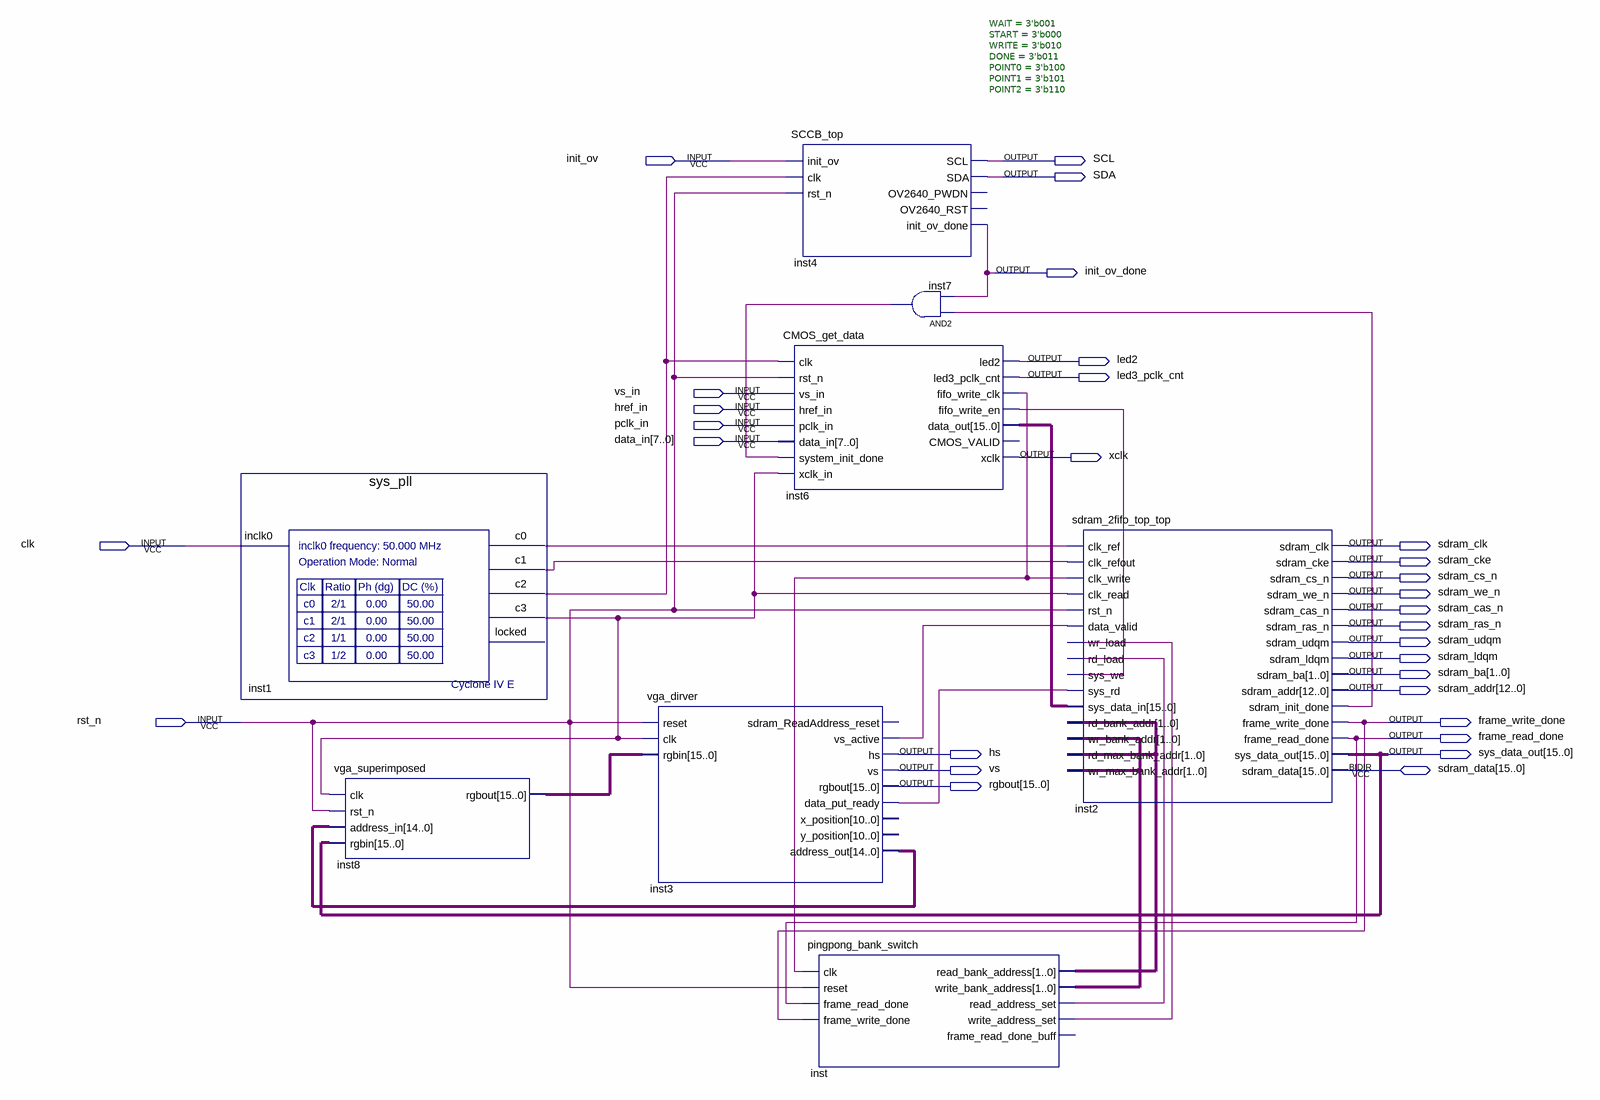
[diagram p0: schematic sheet]
// Quartus schematic sdram_test.bdf as structural Verilog: 8 symbols, 30 pins
module sdram_test (
  input  init_ov,
  input  vs_in,
  input  href_in,
  input  pclk_in,
  input  [7:0] data_in,
  input  clk,
  input  rst_n,
  inout  [15:0] sdram_data,
  output SCL,
  output SDA,
  output init_ov_done,
  output led2,
  output led3_pclk_cnt,
  output xclk,
  output sdram_clk,
  output sdram_cke,
  output sdram_cs_n,
  output sdram_we_n,
  output sdram_cas_n,
  output sdram_ras_n,
  output sdram_udqm,
  output sdram_ldqm,
  output [1:0] sdram_ba,
  output [12:0] sdram_addr,
  output frame_write_done,
  output frame_read_done,
  output hs,
  output [15:0] sys_data_out,
  output vs,
  output [15:0] rgbout
);

  wire inst1_c0, inst1_c1, inst1_c2, inst1_c3, inst2_sdram_init_done, inst3_data_put_ready, inst3_vs_active,
       inst6_fifo_write_clk, inst6_fifo_write_en, inst7_out, inst_read_address_set, inst_write_address_set;
  wire [1:0] inst_read_bank_address, inst_write_bank_address;
  wire [14:0] inst3_address_out;
  wire [15:0] inst6_data_out, inst8_rgbout;

  sys_pll inst1 (.inclk0(clk), .c0(inst1_c0), .c1(inst1_c1), .c2(inst1_c2), .c3(inst1_c3));  // open: locked
  vga_superimposed inst8 (
    .clk(inst1_c3), .rst_n(rst_n), .address_in(inst3_address_out), .rgbin(sys_data_out), .rgbout(inst8_rgbout));
  vga_dirver inst3 (
    .reset(rst_n), .clk(inst1_c3), .rgbin(inst8_rgbout), .vs_active(inst3_vs_active), .hs(hs), .vs(vs),
    .rgbout(rgbout), .data_put_ready(inst3_data_put_ready), .address_out(inst3_address_out));  // open: sdram_ReadAddress_reset, x_position, y_position
  SCCB_top #(.WAIT(3'b001), .START(3'b000), .WRITE(3'b010), .DONE(3'b011), .POINT0(3'b100), .POINT1(3'b101), .POINT2(3'b110)) inst4 (
    .init_ov(init_ov), .clk(inst1_c2), .rst_n(rst_n), .SCL(SCL), .SDA(SDA), .init_ov_done(init_ov_done));  // open: OV2640_PWDN, OV2640_RST
  CMOS_get_data inst6 (
    .clk(inst1_c2), .rst_n(rst_n), .vs_in(vs_in), .href_in(href_in), .pclk_in(pclk_in), .data_in(data_in),
    .system_init_done(inst7_out), .xclk_in(inst1_c3), .led2(led2), .led3_pclk_cnt(led3_pclk_cnt),
    .fifo_write_clk(inst6_fifo_write_clk), .fifo_write_en(inst6_fifo_write_en), .data_out(inst6_data_out),
    .xclk(xclk));  // open: CMOS_VALID
  pingpong_bank_switch inst (
    .clk(inst6_fifo_write_clk), .reset(rst_n), .frame_read_done(frame_read_done),
    .frame_write_done(frame_write_done), .read_bank_address(inst_read_bank_address),
    .write_bank_address(inst_write_bank_address), .read_address_set(inst_read_address_set),
    .write_address_set(inst_write_address_set));  // open: frame_read_done_buff
  and inst7 (inst7_out, inst2_sdram_init_done, init_ov_done);
  sdram_2fifo_top_top inst2 (
    .clk_ref(inst1_c0), .clk_refout(inst1_c1), .clk_write(inst6_fifo_write_clk), .clk_read(inst1_c3),
    .rst_n(rst_n), .data_valid(inst3_vs_active), .wr_load(inst_write_address_set),
    .rd_load(inst_read_address_set), .sys_we(inst6_fifo_write_en), .sys_rd(inst3_data_put_ready),
    .sys_data_in(inst6_data_out), .rd_bank_addr(inst_read_bank_address),
    .wr_bank_addr(inst_write_bank_address), .rd_max_bank_addr(inst_read_bank_address),
    .wr_max_bank_addr(inst_write_bank_address), .sdram_clk(sdram_clk), .sdram_cke(sdram_cke),
    .sdram_cs_n(sdram_cs_n), .sdram_we_n(sdram_we_n), .sdram_cas_n(sdram_cas_n), .sdram_ras_n(sdram_ras_n),
    .sdram_udqm(sdram_udqm), .sdram_ldqm(sdram_ldqm), .sdram_ba(sdram_ba), .sdram_addr(sdram_addr),
    .sdram_init_done(inst2_sdram_init_done), .frame_write_done(frame_write_done),
    .frame_read_done(frame_read_done), .sys_data_out(sys_data_out), .sdram_data(sdram_data));
endmodule
